# EAGLE schematic Works_009 (EAGLE 8.2.1)
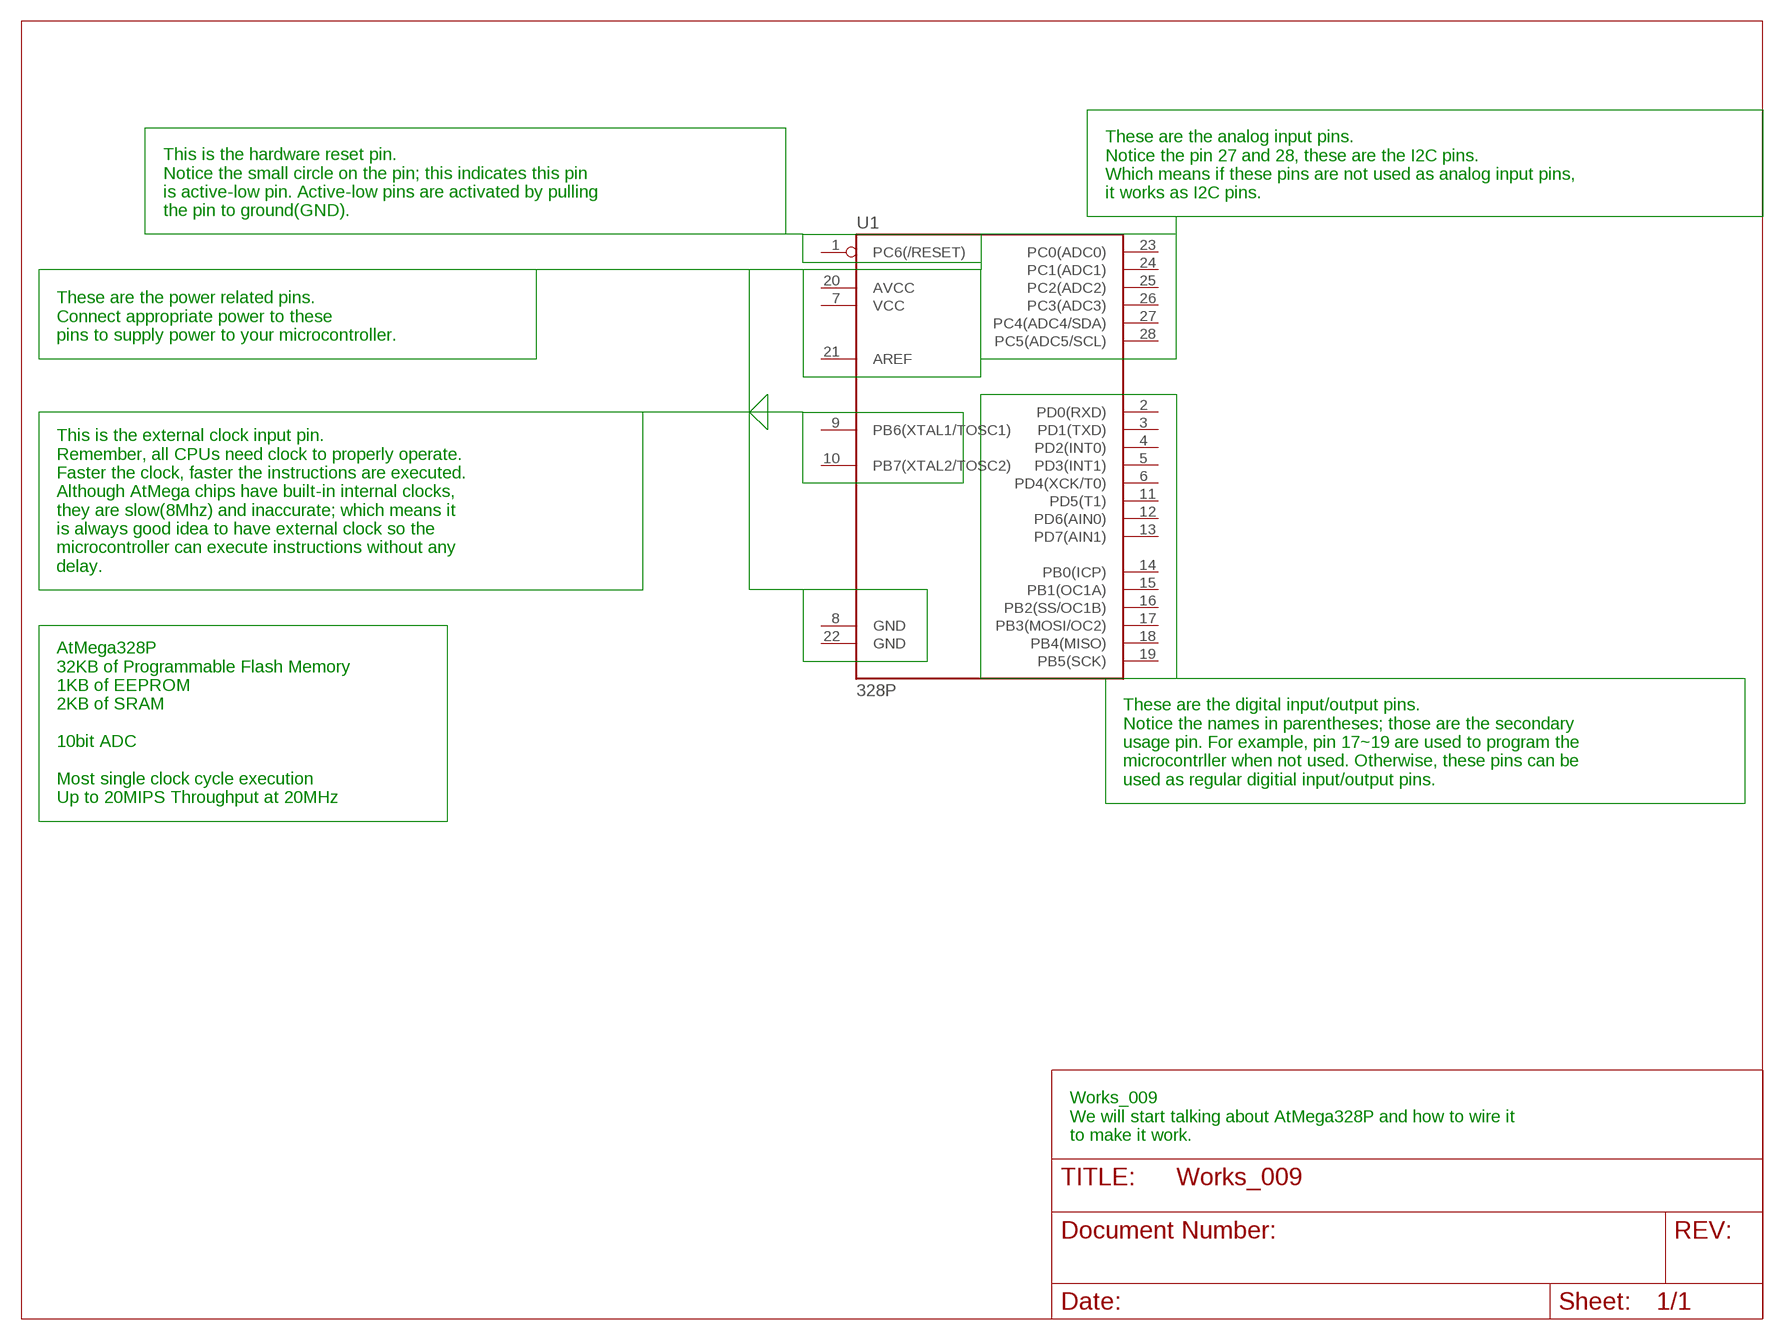
[diagram p0: schematic, sheet 1]

## Parts
U1  328P  ATMEGA328P_PDIP  [DIP28]
Unconnected: U1.1(PC6(/RESET)) U1.2(PD0(RXD)) U1.3(PD1(TXD)) U1.4(PD2(INT0)) U1.5(PD3(INT1)) U1.6(PD4(XCK/T0)) U1.7(VCC) U1.8(GND) U1.9(PB6(XTAL1/TOSC1)) U1.10(PB7(XTAL2/TOSC2)) U1.11(PD5(T1)) U1.12(PD6(AIN0)) U1.13(PD7(AIN1)) U1.14(PB0(ICP)) U1.15(PB1(OC1A)) U1.16(PB2(SS/OC1B)) U1.17(PB3(MOSI/OC2)) U1.18(PB4(MISO)) U1.19(PB5(SCK)) U1.20(AVCC) U1.21(AREF) U1.22(GND) U1.23(PC0(ADC0)) U1.24(PC1(ADC1)) U1.25(PC2(ADC2)) U1.26(PC3(ADC3)) U1.27(PC4(ADC4/SDA)) U1.28(PC5(ADC5/SCL))

## Notes on the sheet
- These are the analog input pins.
  Notice the pin 27 and 28, these are the I2C pins.
  Which means if these pins are not used as analog input pins,
  it works as I2C pins.
- This is the hardware reset pin.
  Notice the small circle on the pin; this indicates this pin
  is active-low pin. Active-low pins are activated by pulling
  the pin to ground(GND).
- These are the power related pins.
  Connect appropriate power to these
  pins to supply power to your microcontroller.
- This is the external clock input pin.
  Remember, all CPUs need clock to properly operate.
  Faster the clock, faster the instructions are executed.
  Although AtMega chips have built-in internal clocks,
  they are slow(8Mhz) and inaccurate; which means it
  is always good idea to have external clock so the
  microcontroller can execute instructions without any
  delay.
- These are the digital input/output pins.
  Notice the names in parentheses; those are the secondary
  usage pin. For example, pin 17~19 are used to program the
  microcontrller when not used. Otherwise, these pins can be
  used as regular digitial input/output pins.
- AtMega328P
  32KB of Programmable Flash Memory
  1KB of EEPROM
  2KB of SRAM
  
  10bit ADC
  
  Most single clock cycle execution
  Up to 20MIPS Throughput at 20MHz
- Works_009
  We will start talking about AtMega328P and how to wire it
  to make it work.

## Library data of the parts
U1 = SparkFun-IC-Microcontroller:ATMEGA328P_PDIP: Atmel 328P Through hole ATMEGA328P uC used in the Arduino 32kb flash, 1k EEPROM, 2k SRAM Datasheet <http://www.sparkfun.com/datasheets/Components/SMD/ATMega328.pdf> SparkFun Products Storefront component: AVR 28 Pin 20MHz 32K 6A/D - ATMega328P <https://www.sparkfun.com/products/9061> (COM-09061) SparkFun Simon Says - Through-Hole Soldering Kit <https://www.sparkfun.com/products/10547> (KIT-10547) SparkFun Learn to Solder - Simon Says <https://www.sparkfun.com/products/13708> (KIT-13708) SparkFun BigTime Watch Kit <https://www.sparkfun.com/products/11734> (KIT-11734) SparkFun ClockIt <https://www.sparkfun.com/products/10930> (KIT-10930) SparkFun Serial Enabled LCD Kit <https://www.sparkfun.com/products/10097> (LCD-10097) SparkFun Simon Tilts - Through Hole Soldering Kit <https://www.sparkfun.com/products/12634> (KIT-12634) SparkFun Frequency Counter Kit <https://www.sparkfun.com/products/10140> (KIT-10140) FabFM Radio Kit <https://www.sparkfun.com/products/11043> (KIT-11043) SparkFun Binary Blaster Kit <https://www.sparkfun.com/products/12037> (KIT-12037) SparkFun Metro-Gnome <https://www.sparkfun.com/products/9236> (KIT-09236) ATmega328 with Arduino Optiboot (Uno) <https://www.sparkfun.com/products/10524> (DEV-10524); PROD_ID: IC-09136